# Altium schematic sheet 10-RGB模块原理图.SchDoc
size A4
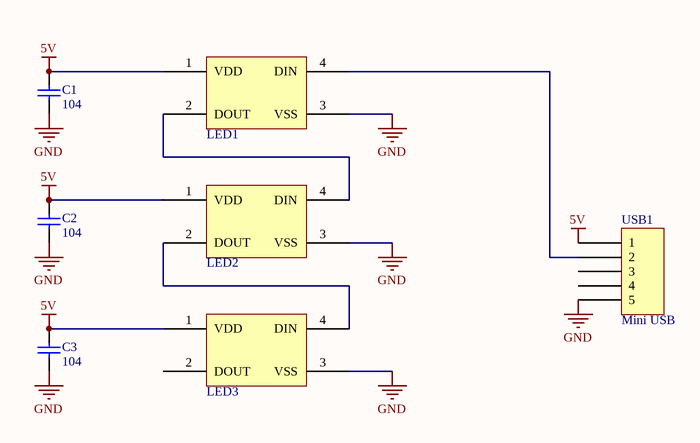
[diagram p0: 10-RGB模块原理图.SchDoc]

## Parts
C1  value 104  [0603]  (hidden comment: Cap)
C2  value 104  [0603]  (hidden comment: Cap)
C3  value 104  [0603]  (hidden comment: Cap)
LED1  RGB WS2811  [RGB]  (value not drawn)
LED2  RGB WS2811  [RGB]  (value not drawn)
LED3  RGB WS2811  [RGB]  (value not drawn)
USB1  Mini USB  [USB/SM0.8-6H5]

## Nets
5V: C1.2 C2.2 C3.2 LED1.1(VDD) LED2.1(VDD) LED3.1(VDD) USB1.1
GND: C1.1 C2.1 C3.1 LED1.3(VSS) LED2.3(VSS) LED3.3(VSS) USB1.5
NetLED1_2: LED1.2(DOUT) LED2.4(DIN)
NetLED1_4: LED1.4(DIN) USB1.2
NetLED2_2: LED2.2(DOUT) LED3.4(DIN)

Not connected (* = marked no-connect by the designer): LED3 2(DOUT); USB1 3 4

## Library data of the parts
C1-C3 = Cap: Capacitor; Published: 8-Jun-2000; LatestRevisionDate: 17-Jul-2002; LatestRevisionNote: Re-released for DXP Platform.; PackageReference: RAD-0.3; Publisher: Altium Limited